# Altium schematic sheet Power_Supplies.SchDoc
size B
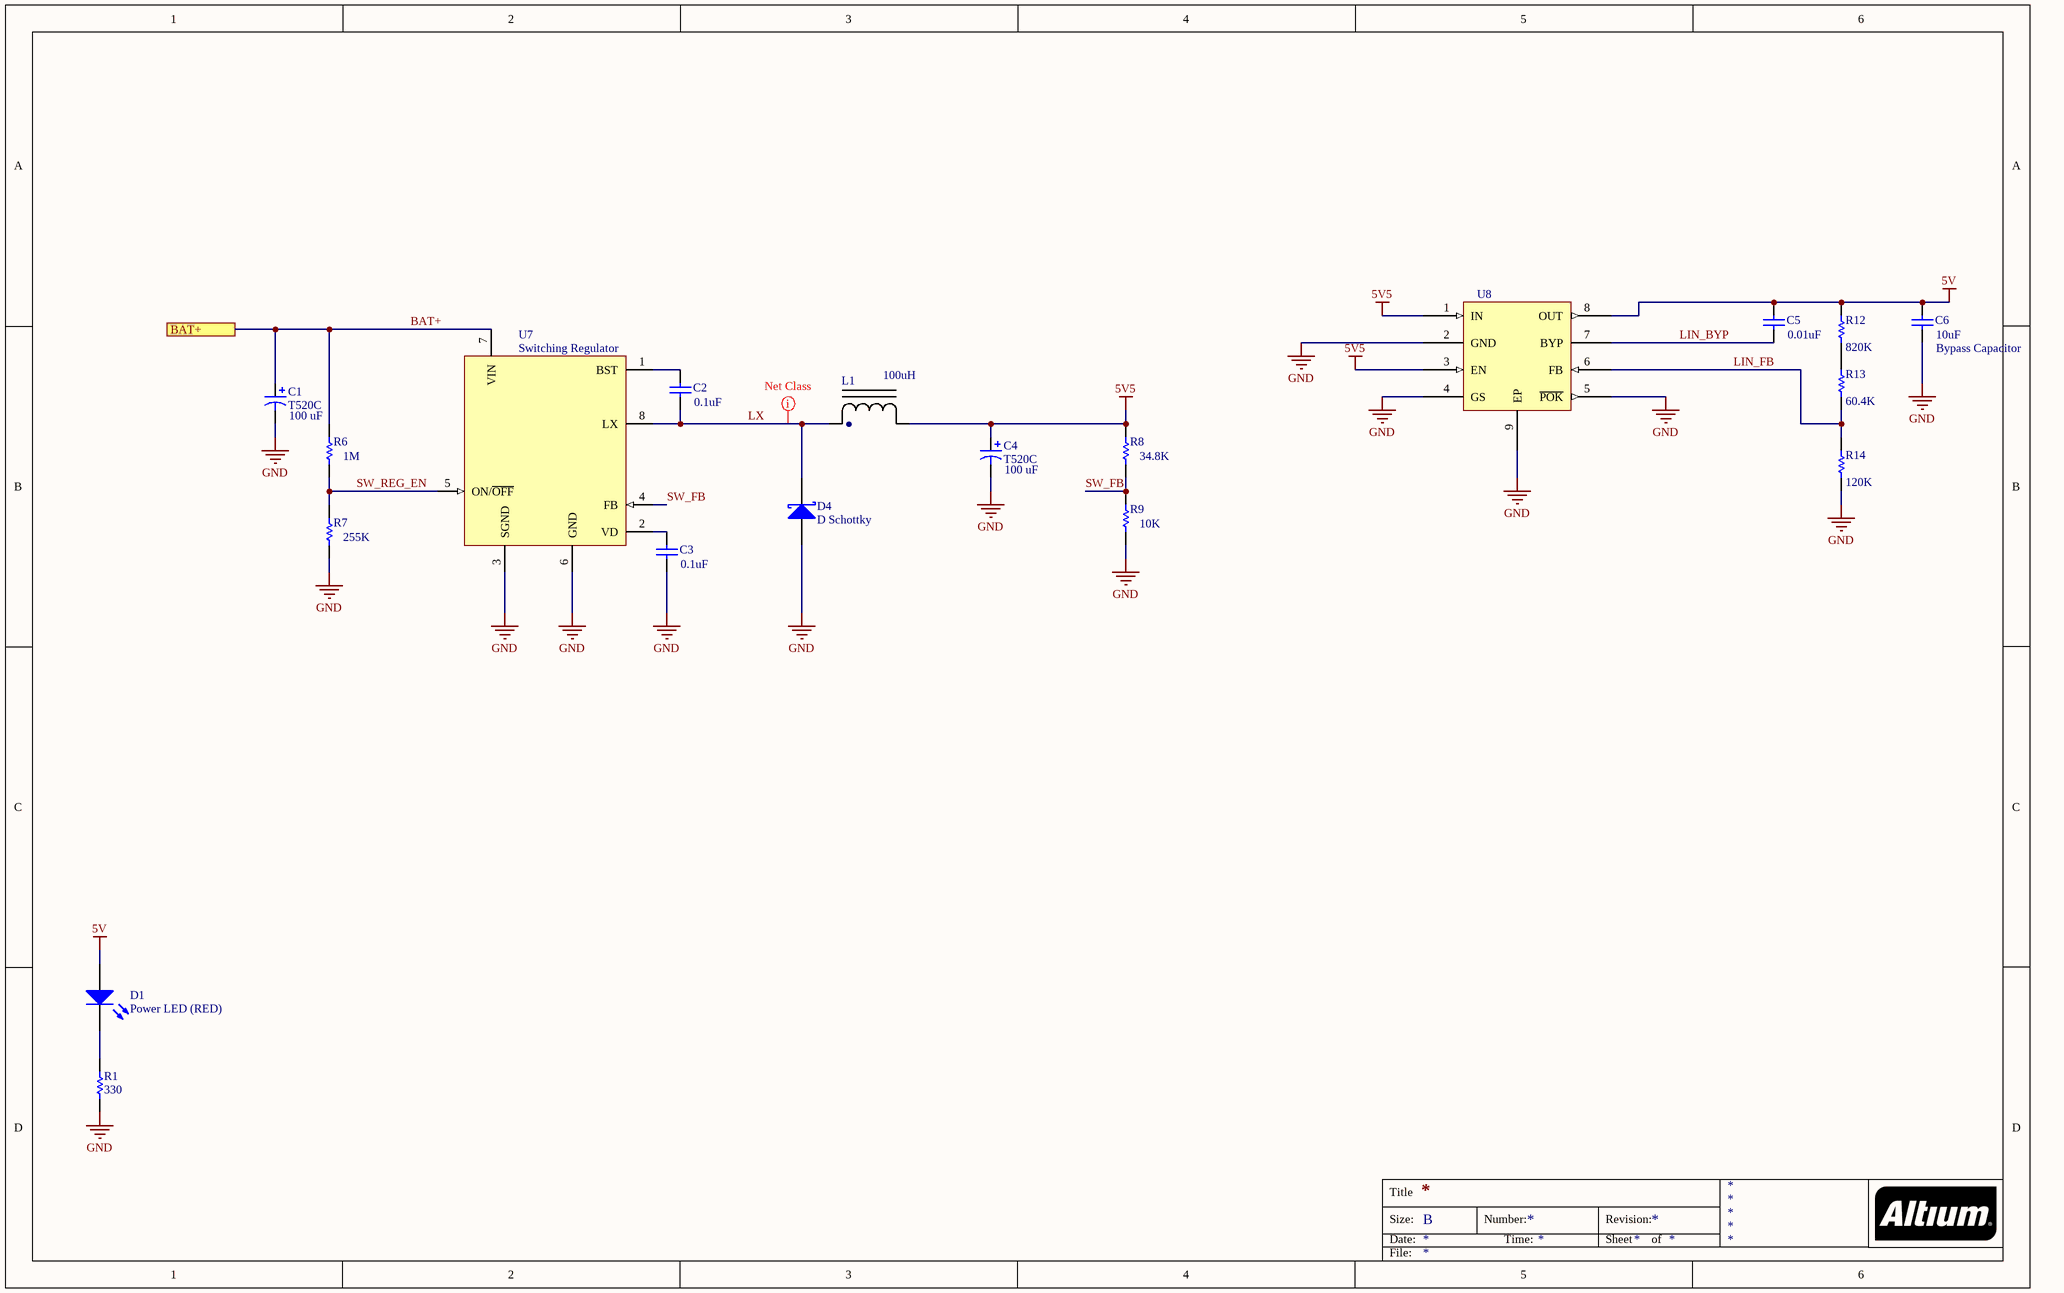
[diagram p0: Power_Supplies.SchDoc]

## Parts
C1  T520C  value 100 uF  [C]
C2  value 0.1uF  [1608[0603]]  (hidden comment: Cap)
C3  value 0.1uF  [1608[0603]]  (hidden comment: Cap)
C4  T520C  value 100 uF  [C]
C5  value 0.01uF  [1608[0603]]
C6  Bypass Capacitor  value 10uF  [C1206]
D1  Power LED (RED)  [1608[0603]]
D4  D Schottky  [SOD123]
L1  value 100uH  [UP1B]  (hidden comment: UP1B-101-R)
R1  value 330  [1608[0603]]  (hidden comment: Current Limiting Resistor)
R6  value 1M  [1608[0603]]  (hidden comment: Res1)
R7  value 255K  [1608[0603]]  (hidden comment: Res1)
R8  value 34.8K  [1608[0603]]
R9  value 10K  [1608[0603]]
R12  value 820K  [1608[0603]]  (hidden comment: Res1)
R13  value 60.4K  [1608[0603]]  (hidden comment: Res1)
R14  value 120K  [1608[0603]]  (hidden comment: Res1)
U7  Switching Regulator  [SOIC8_N]
U8  MAX8902BATA+T  [8 TDFN-EP]  (value not drawn)

## Ports
BAT+

## Nets
5V: C5.2 C6.2 D1.1(A) R12.2 U8.8(OUT)
5V5: C4.1 L1.2 R8.2 U8.1(IN) U8.3(EN)
GND: C1.2 C3.2 C4.2 C6.1 D4.1(K) R1.1 R7.1 R9.1 R14.1 U7.3(SGND) U7.6(GND) U8.2(GND) U8.4(GS) U8.5(~{POK}) U8.9(EP)
BAT+: C1.1 R6.2 U7.7(VIN) ; port BAT+
LIN_BYP: C5.1 U8.7(BYP)
LIN_FB: R13.1 R14.2 U8.6(FB)
LX: C2.2 D4.2(A) L1.1 U7.8(LX)
SW_FB: R8.1 R9.2 U7.4(FB)
SW_REG_EN: R6.1 R7.2 U7.5(ON/~{OFF})
NetC2_1: C2.1 U7.1(BST)
NetC3_1: C3.1 U7.2(VD)
NetD1_2: D1.2(K) R1.2
NetR12_1: R12.1 R13.2

## Layout directives
net class POWER: LX

## Notes on the sheet
- Title
- Size:
- Date:
- B
- Number:
- Time:
- Revision:
- Sheet
- of
- File:
- (in symbol UP1B-100-R) .

## Library data of the parts
C1 C4 = T520D: Tantalum Capacitors - Polymer SMD 6.3volts 100uF 20% ESR=5mOhms; Mfr Case Code: C Case; Manufacturer: KEMET; Manufacturer Part Number: T520C107M006ANE005; Voltage Rating: 6.3 VDC; ESR: 5 mOhms; Supplier 1: Mouser; Supplier Part Number 1: 80-T520C107M6ANE5; Package / Case: 2312 (6032 metric); Height: 2.5 mm; Length: 6 mm; Width: 3.2 mm; Case Code - mm: 6032; Minimum Operating Temperature: - 55 C; Series: T520; Tolerance: 20 %; Case Code - in: 2312; ComponentLink1URL: http://www.mouser.com/ds/2/212/KEM_T2076_T52X-530-1104134.pdf; ComponentLink1Description: http://www.mouser.com/ds/2/212/KEM_T2076_T52X-530-1104134.pdf; Pricing: 1=2.05, 10=1.63, 100=1.18, 500=0.800, 1000=0.699, 2500=0.650, 10000=0.625 (USD)
C2 C3 = Cap: Multilayer Ceramic Capacitors MLCC - SMD/SMT 0603 .1uF 50volts X7R 10%; Manufacturer Part Number: VJ0603Y104KXAAC; Manufacturer: Vishay Semiconductors; Voltage Rating (DC): 50V; Supplier 1: Mouser; Supplier Part Number 1: 77-VJ0603Y104KXAAC; Min Operating Temperature: -55°C; Max Operating Temperature: 150°C; Tolerance: 10%; Lead Free: Lead Free; Depth: 0.8mm; Case/Package: 0603; Dielectric: X7R; Length: 1.6mm; ComponentLink1Description: Datasheet; ComponentLink1URL: https://www.mouser.com/datasheet/2/427/vjcommercialseries-222796.pdf
C5 = Cap: Multilayer Ceramic Capacitors MLCC - SMD/SMT 50volts 10000pF X7R 5%; Manufacturer Part Number: C0603C103J5RALTU; Manufacturer: KEMET; Dissipation Factor: 2.5%; Voltage Rating: 50V; ComponentLink1Description: Datasheet; ComponentLink1URL: http://www.kemet.com/docfinder?Partnumber=C0603C103J5RACTU; Supplier 1: Mouser; Supplier Part Number 1: 80-C0603C103J5RAL; Dielectric: X7R; Thickness: 0.034inch; Height: 0.8mm; Lead Pitch: 0.7mm; Width: 0.8mm; Depth: 0.8mm; Length: 1.6mm; Case Code (Imperial): 0603; Min Operating Temperature: -55°C; Dielectric Material: Ceramic; Max Operating Temperature: 125°C; Tolerance: 5%
C6 = Cap: Multilayer Ceramic Capacitors MLCC - SMD/SMT SOFT 1206 25V 10uF X7R 20% T: 1.6mm; Manufacturer Part Number: C3216X7R1E106M160AE; Manufacturer: TDK; Supplier 1: Mouser; Supplier Part Number 1: 810-C3216X7R1E106MST; Weight: 0.000571oz; Depth: 1.6mm; Composition: Ceramic; Min Operating Temperature: -55°C; Thickness: 0.071inch; Max Operating Temperature: 125°C; Voltage Rating: 25V; Dielectric: X7R; Width: 0.063inch; Lead Free: Lead Free; Tolerance: 20%; Height: 1.8mm; Case Code (Imperial): 1206; Length: 3.2mm; ComponentLink1URL: https://datasheet.ciiva.com/6285/mlcc-commercial-soft-en-6285640.pdf; ComponentLink1Description: https://datasheet.ciiva.com/6285/mlcc-commercial-soft-en-6285640.pdf; ComponentLink2URL: https://datasheet.ciiva.com/24218/c3216x7r1e106m160ae-265316-24218060.pdf; ComponentLink2Description: https://datasheet.ciiva.com/24218/c3216x7r1e106m160ae-265316-24218060.pdf; ComponentLink3URL: https://datasheet.ciiva.com/6285/mlcc-commercial-soft-en-6285643.pdf; ComponentLink3Description: https://datasheet.ciiva.com/6285/mlcc-commercial-soft-en-6285643.pdf
D1 = LED0: Standard LEDs - SMD Super Red, 660nm 1.7V, 45mcd; Manufacturer Part Number: SML-LX0603SRW-TR; Manufacturer: Lumex; Forward Current: 20mA; Viewing Angle: 140°; Power Rating: 50mW; Lens Colour: White; Lens Style: Diffused,Colorless,Rectangular; Lens Transparency: Diffused; Supplier 1: Mouser; Supplier Part Number 1: 696-SML-LX0603SRW; Min Operating Temperature: -25°C; Length: 1.6mm; Lead Free: Lead Free; Case Code (Imperial): 0603; Colour: Red; Forward Voltage: 1.7V; Max Operating Temperature: 85°C; Wavelength: 660nm; Height: 0.6mm; Luminous Intensity: 45mcd; Case Code (Metric): 1608; Width: 0.8mm; Illumination Colour: Red; Test Current: 20mA; ComponentLink1URL: https://datasheet.ciiva.com/2110/sml-lx0603srw-tr-2110094.pdf; ComponentLink1Description: https://datasheet.ciiva.com/2110/sml-lx0603srw-tr-2110094.pdf; ComponentLink2URL: https://datasheet.ciiva.com/7639/269316-7639176.pdf; ComponentLink2Description: https://datasheet.ciiva.com/7639/269316-7639176.pdf; ComponentLink3URL: https://datasheet.ciiva.com/16200/sml-lx0603srw-tr-16200056.pdf; ComponentLink3Description: https://datasheet.ciiva.com/16200/sml-lx0603srw-tr-16200056.pdf; ComponentLink4URL: https://datasheet.ciiva.com/2110/sml-lx0603srw-tr-2110093.pdf; ComponentLink4Description: https://datasheet.ciiva.com/2110/sml-lx0603srw-tr-2110093.pdf; ComponentLink5URL: https://datasheet.ciiva.com/7639/269316-7639175.pdf; ComponentLink5Description: https://datasheet.ciiva.com/7639/269316-7639175.pdf; ComponentLink6URL: https://datasheet.ciiva.com/2110/sml-lx0603srw-tr-2110095.pdf; ComponentLink6Description: https://datasheet.ciiva.com/2110/sml-lx0603srw-tr-2110095.pdf; ComponentLink7URL: https://datasheet.ciiva.com/30115/sml-lx0603srw-tr-30115864.pdf; ComponentLink7Description: https://datasheet.ciiva.com/30115/sml-lx0603srw-tr-30115864.pdf; ComponentLink8URL: https://datasheet.ciiva.com/15967/sml-lx0603srw-tr-15967174.pdf; ComponentLink8Description: https://datasheet.ciiva.com/15967/sml-lx0603srw-tr-15967174.pdf; ComponentLink9URL: https://datasheet.ciiva.com/4689/sml-lx0603srw-tr-113242-4689205.pdf; ComponentLink9Description: https://datasheet.ciiva.com/4689/sml-lx0603srw-tr-113242-4689205.pdf
D4 = D Schottky: Schottky Diodes & Rectifiers Schottky Power Rect .5a; Manufacturer Part Number: MBR0520L; Manufacturer: ON Semiconductor / Fairchild; If - Forward Current: 0.5 A; Ifsm - Forward Surge Current: 5.5 A; Ir - Reverse Current: 250 uA; Vf - Forward Voltage: 0.385 V; Vrrm - Repetitive Reverse Voltage: 20 V; LatestRevisionDate: 17-Jul-2002; LatestRevisionNote: Re-released for DXP Platform.; Code_JEDEC: DO-214-AA; Supplier 1: Mouser; Supplier Part Number 1: 512-MBR0520L; Height: 1.17 mm (Max); Technology: Si; Operating Temperature Range: - 65 C to + 125 C; Length: 2.85 mm (Max); Package / Case: SOD-123; Type: Schottky Diode; Width: 1.8 mm (Max); Datasheet: http://www.mouser.com/ds/2/308/MBR0520L-1124987.pdf; Supplier 2: Digi-Key; Supplier Part Number 2: MBR0520LCT-ND
L1 = UP1B-100-R: Fixed Inductors 100uH 0.53A 1.11ohms; Manufacturer: Eaton; DC Resistance (DCR): 1.11R; Tolerance: 20%; Current Rating: 470mA; Shielding: Unshielded; Saturation Current: 530mA; Test Frequency: 100kHz; Core Material: Ferrite; Supplier 1: Mouser; Supplier Part Number 1: 704-UP1B-101-R; Max Operating Temperature: 85°C; Manufacturer Part Number: UP1B-101-R; DC Current: 470mA; Width: 0.24inch; Depth: 6.1mm; Min Operating Temperature: -40°C; Height - Seated (Max): 0.197inch; ComponentLink1Description: Datasheet; ComponentLink1URL: https://www.mouser.com/datasheet/2/87/BUS_Elx_PM_4308_UNI_PAC_Power_Inductors-268242.pdf
R1 = Res1: Thick Film Resistors - SMD 330 ohm 0.5% 0.33W AEC-Q200; Manufacturer: KOA Speer; Manufacturer Part Number: SG73G1JTTD3300D; Power Rating: 330mW; Supplier 1: Mouser; Supplier Part Number 1: 660-SG73G1JTTD3300D; ComponentLink1Description: Datasheet; ComponentLink1URL: https://www.mouser.com/datasheet/2/219/SG73G-1316861.pdf; Tolerance: 0.5%
R6 = Res1: Thin Film Resistors - SMD 1M OHM .1% 25PPM; Manufacturer Part Number: RT0603BRD071ML; Manufacturer: Yageo; Tolerance: 0.1%; Max Power Dissipation: 100mW; Temperature Coefficient: 25ppm/°C; Supplier 1: Mouser; Supplier Part Number 1: 603-RT0603BRD071ML; Length: 0.063inch; Width: 0.031inch; Min Operating Temperature: -55°C; Max Operating Temperature: 155°C; Height: 0.022inch; Case/Package: 0603; Composition: Thin Film; ComponentLink1Description: Datasheet; ComponentLink1URL: https://www.mouser.com/datasheet/2/447/PYu-RT_1-to-0.01_RoHS_L_9-1222720.pdf
R7 = Res1: Thin Film Resistors - SMD 255Kohms .1% 25ppm; Manufacturer: Vishay Dale; Manufacturer Part Number: TNPW0603255KBEEN; Voltage Rating: 75V; Power Rating: 100mW; Tolerance: 0.1%; Temperature Coefficient: 25ppm/°C; Supplier 1: Mouser; Supplier Part Number 1: 71-TNPW0603255KBEEN; Width: 0.8mm; Weight: 7.1E-05oz; Length: 0.063inch; Max Operating Temperature: 125°C; Case Code (Imperial): 0603; Radiation Hardening: No; Composition: Thin Film; Contact Plating: Tin; Min Operating Temperature: -55°C; Height: 0.022inch; ComponentLink1URL: https://datasheet.ciiva.com/2614/tnpw-e3-2614598.pdf; ComponentLink1Description: Datasheet
R8 = Res1: Thin Film Resistors - SMD 150mW 34.8kohm 0.1% 25PPM 0603; Manufacturer: Vishay; Manufacturer Part Number: PAT0603E3482BST1; Voltage Rating: 75 V; Temperature Coefficient: 25 PPM / C; Supplier 1: Mouser; Supplier Part Number 1: 71-PAT0603E3482BST1; Power Rating: 150 mW; Tolerance: 0.1 %; Operating Temperature Range: - 55 C to + 125 C; Package / Case: 0603 (1608 metric); Width: 0.762 mm; ComponentLink1Description: Datasheet; ComponentLink1URL: http://www.mouser.com/ds/2/427/pat-247403.pdf
R9 = Res1: Thin Film Resistors - SMD 150mW 10kohm 0.1% 25PPM 0603; Manufacturer: Vishay; Manufacturer Part Number: PAT0603E1002BST1; Temperature Coefficient: 25 PPM / C; Voltage Rating: 75 V; Supplier 1: Mouser; Supplier Part Number 1: 71-PAT0603E1002BST1; Supplier 2: Digi-Key; Supplier Part Number 2: PAT10KACT-ND; Length: 1.524 mm; Power Rating: 150 mW; Height: 0.254 mm; Tolerance: 0.1 %; Package / Case: 0603 (1608 metric); Operating Temperature Range: - 55 C to + 125 C; Width: 0.762 mm; Datasheet: http://www.mouser.com/ds/2/427/pat-247403.pdf; ComponentLink1Description: Datasheet; ComponentLink1URL: http://www.mouser.com/ds/2/427/pat-247403.pdf
R12 = Res1: Thin Film Resistors - SMD CPF0603 820K 0.1% 25PPM 5K RL; Manufacturer: TE Connectivity; Manufacturer Part Number: CPF0603B820KE; Power Rating: 63mW; Temperature Coefficient: 25ppm/°C; Supplier 1: Mouser; Supplier Part Number 1: 279-CPF0603B820KE; ComponentLink1URL: https://datasheet.ciiva.com/11819/0900766b80d2f5da-11819682.pdf; ComponentLink1Description: https://datasheet.ciiva.com/11819/0900766b80d2f5da-11819682.pdf; Case/Package: 0603; Height: 0.45mm; Min Operating Temperature: -55°C; Length: 1.6mm; Depth: 0.8mm; Tolerance: 0.1%; Max Operating Temperature: 125°C
R13 = Res1: Thin Film Resistors - SMD .063W 60.4K ohm 0.1% 25ppm; Manufacturer: TT Welwyn; Manufacturer Part Number: PCF0603R-60K4BT1; Temperature Coefficient: 25ppm/°C; Power Rating: 63mW; Voltage Rating: 50V; Supplier 1: Mouser; Supplier Part Number 1: 756-PCF0603R-60K4BT1; Width: 0.8mm; Composition: Metal Film,Thin Film; Tolerance: 0.1%; Max Operating Temperature: 125°C; Min Operating Temperature: -55°C; ComponentLink1URL: https://datasheet.ciiva.com/48780/1315872-48780789.pdf; ComponentLink1Description: https://datasheet.ciiva.com/48780/1315872-48780789.pdf; ComponentLink2URL: https://datasheet.ciiva.com/48780/1315872-48780790.pdf; ComponentLink2Description: https://datasheet.ciiva.com/48780/1315872-48780790.pdf; ComponentLink3URL: https://datasheet.ciiva.com/12834/pcf-437472-12834504.pdf; ComponentLink3Description: https://datasheet.ciiva.com/12834/pcf-437472-12834504.pdf
R14 = Res1: Thin Film Resistors - SMD CPF 0603 120K 0.1% 25PPM 1K RL; Manufacturer Part Number: CPF0603B120KE1; Manufacturer: TE Connectivity; Power Rating: 63mW; Temperature Coefficient: 25ppm/°C; Voltage Rating: 50V; Supplier 1: Mouser; Supplier Part Number 1: 279-CPF0603B120KE1; Case/Package: 0603; Min Operating Temperature: -55°C; Height: 0.45mm; Max Operating Temperature: 155°C; Width: 0.8mm; Weight: 7.1E-05oz; Tolerance: 0.1%; Length: 1.55mm; Composition: Thin Film; ComponentLink1URL: https://datasheet.ciiva.com/22670/1723857-22670584.pdf; ComponentLink1Description: https://datasheet.ciiva.com/22670/1723857-22670584.pdf; ComponentLink2URL: https://datasheet.ciiva.com/12793/eng-ds-1773200-i-12793932.pdf; ComponentLink2Description: https://datasheet.ciiva.com/12793/eng-ds-1773200-i-12793932.pdf
U7 = MAX5035: Switching Voltage Regulators 1A 76V MAXPower Step-Down; Manufacturer: Maxim; Manufacturer Part Number: MAX5035DASA+T; Max Output Voltage: 13.2V; Switching Frequency: 125kHz; Output Type: Adjustable; Min Output Voltage: 1.25V; Output Configuration: Positive; Min Input Voltage: 7.5V; ComponentLink1Description: Datasheet; ComponentLink1URL: https://datasheets.maximintegrated.com/en/ds/MAX5035.pdf; Supplier 1: Mouser; Max Output Current: 1A; Max Operating Temperature: 125°C; Max Input Voltage: 76V; Min Operating Temperature: -40°C; Output Voltage: 13.2V; Supplier Part Number 1: 700-MAX5035DASA-T-NR
U8 = MAX8902BATA+T: LDO Voltage Regulators 500mA LDO Regulator; Manufacturer: Maxim Integrated; Manufacturer Part Number: MAX8902AATA+T; Input Voltage Range: 1.7V to 5.5V; Output Voltage Range: 0.6V to 5.3V; Output Noise: 16uV (RMS) from 10Hz to 100KHz; PSRR at 5KHz: 92dB; Accuracy: +/- 1.5% (over load, line, and temperature); Output Voltage Selection: Pin selection; Max Output Voltage: 5.3V; Max Power Dissipation: 953.5mW; Min Current Limit: 600mA; Min Output Voltage: 600mV; Output Type: Adjustable; Polarity: Positive; Power Supply Rejection Ratio (PSRR): 85dB; Supplier 1: Mouser; Supplier Part Number 1: 700-MAX8902BATAT; Datasheet: https://datasheets.maximintegrated.com/en/ds/MAX8902-MAX8902B.pdf; ComponentLink1Description: Datasheet; ComponentLink1URL: https://datasheets.maximintegrated.com/en/ds/MAX8902-MAX8902B.pdf; Max Operating Temperature: 125°C; Max Output Current: 500mA; Min Operating Temperature: -40°C; Power Rating: 953.5mW